# EAGLE design PID_heater (EAGLE 9.3.0)
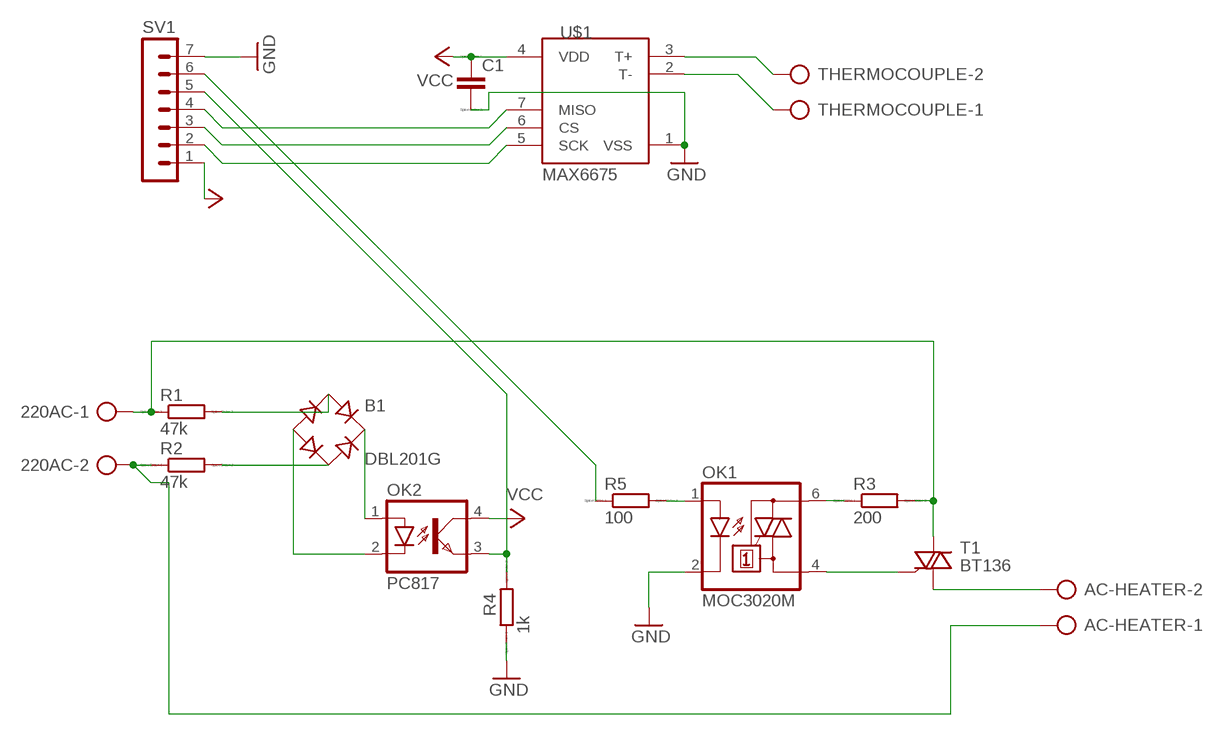
[diagram p0: schematic, sheet 1]

## Parts
220AC  AK300/2  [AK300/2]
AC-HEATER  AK300/2  [AK300/2]
B1  DBL201G  [DB]
C1  0.1u  C  [C0805]
OK1  MOC3020M  [DIL06]
OK2  PC817  [DIL04]
R1  47k  R  [R0805]
R2  47k  R  [R0805]
R3  200  R  [R0805]
R4  1k  R  [R0805]
R5  100  R  [R0805]
SV1  MA07-1  [MA07-1]
T1  BT136  [TO220AB]
THERMOCOUPLE  AK300/2  [AK300/2]
U$1  MAX6675  [SO08]

## Nets
GND: C1.2 OK1.2(C) R4.1 SV1.7 U$1.1(VSS)
N$1: OK1.6(A2) R3.1
N$2: 220AC.1 R1.1 R3.2 T1.2(A2)
N$3: 220AC.2 AC-HEATER.1 R2.1
N$4: B1.AC1 R1.2
N$5: B1.AC2 R2.2
N$6: B1.+ OK2.1(A)
N$7: B1.- OK2.2(C)
N$8: OK2.3(EMIT) R4.2 SV1.5
N$9: OK1.1(A) R5.2
N$10: OK1.4(A1) T1.3(G)
N$11: THERMOCOUPLE.2 U$1.3(T+)
N$12: AC-HEATER.2 T1.1(A1)
N$13: THERMOCOUPLE.1 U$1.2(T-)
N$14: R5.1 SV1.6
N$15: SV1.4 U$1.7(MISO)
N$16: SV1.3 U$1.6(CS)
N$17: SV1.2 U$1.5(SCK)
VCC: C1.1 OK2.4(COL) SV1.1 U$1.4(VDD)

## Library data of the parts
220AC AC-HEATER THERMOCOUPLE = con-ptr500:AK300/2: CONNECTOR; OC_FARNELL: unknown; OC_NEWARK: unknown
B1 = rectifier:DB?*G: Single Phase 1.0 AMP Glass Passivated Bridge Rectifier Taiwan Semiconductor Co.,Ltd. - TSC Source: http://www.taiwansemi.com/TSCbig5/ezcatfiles/cust/img/img/db101g.pdf http://www.ts.com.tw/db/pictures/modules/PDT/PDT060207001/DBLS201G.pdf
C1 = eagle-ltspice:C: CAPACITOR, European symbol; SPICEMODEL: NONE; SPICEPREFIX: C
OK1 = optocoupler:MOC30*M: RANDOM-PHASE OPTOISOLATORS TRIAC DRIVER OUTPUT Source: http://www.fairchildsemi.com MOC3020-M.pdf; MF: FAIRCHILD SEMICONDUCTOR; MPN: MOC3020-M; OC_FARNELL: 1505425; OC_NEWARK: 72K8895
OK2 = optocoupler:PC817: SHARP OPTO COUPLER; MPN: PC817X4J000F; OC_FARNELL: 9707727; OC_NEWARK: 97K7059
R1-R5 = eagle-ltspice:R: RESISTOR, European symbol; SPICEMODEL: NONE; SPICEPREFIX: R
SV1 = con-lstb:MA07-1: PIN HEADER; OC_FARNELL: unknown; OC_NEWARK: unknown
T1 = triac:BT136: Triac BT136 series E sensitive gate Source: http://www.nxp.com/acrobat_download/datasheets/BT136_SERIES_E_2.pdf
U$1 = max6675:MAX6675

## Board
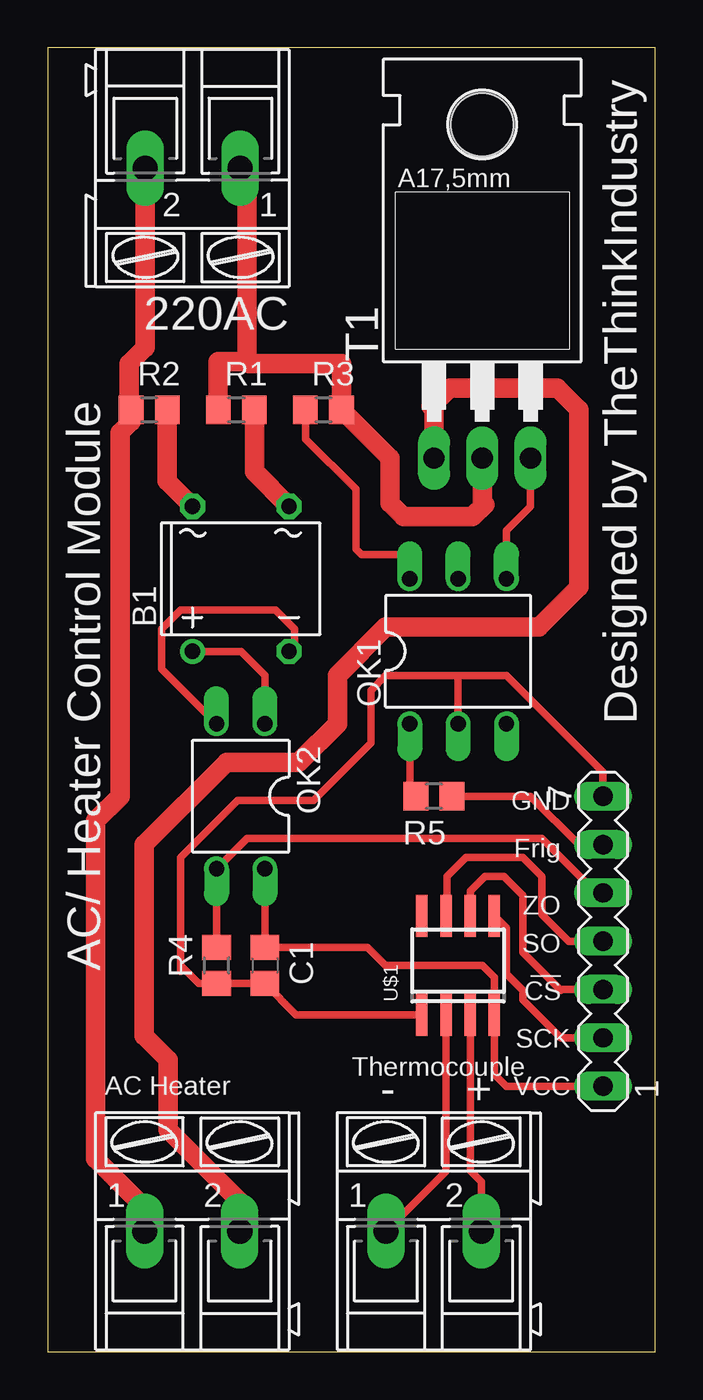
[diagram p1: board, top side]
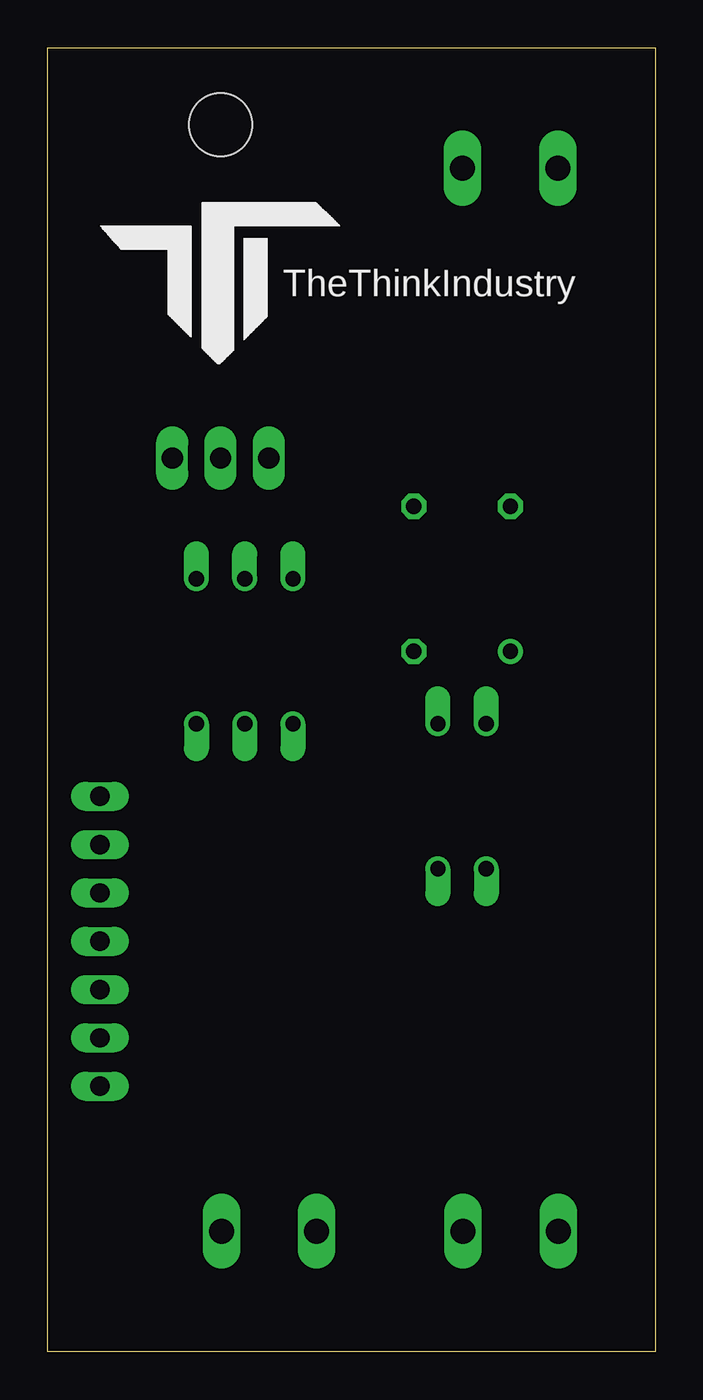
[diagram p2: board, bottom side, seen from below]

Size 31.96 x 68.57 mm. Coordinates in mm from the lower left corner, seen from the top.
Outline: 0,0 31.96,0 31.96,68.57 0,68.57 0,0
Copper layers (1*16): Top 0.035mm / dielectric 1.5mm / Bottom 0.035mm
Design rules "default": minimum track width 6mil, minimum drill 0.35mm, track to track 6mil, track to pad 6mil, pad to pad 6mil, via to via 6mil, smd to smd 6mil, copper to edge 40mil, drill to drill 6mil, minimum pad ring 10mil, minimum via ring 8mil, stop-mask expansion 4mil, vias tented up to drill 0mil, thermal gap 10mil

### Footprints (pad centres in the part's own frame; a part is rotated, then mirrored left to right if it is on the bottom)
AK300/2 = drill 1.321 long: 1 -2.515,0; 2 2.489,0
DB = drill 0.813: + -2.54,-3.81 | drill 0.813 octagon: - 2.54,-3.81; AC1 2.54,3.81; AC2 -2.54,3.81
C0805 = smd 1.3 x 1.5: 1 -0.95,0; 2 0.95,0
DIL06 = drill 0.813 offset: 1 -2.54,-3.81; 2 0,-3.81; 3 2.54,-3.81; 4 2.54,3.81; 5 0,3.81; 6 -2.54,3.81
DIL04 = drill 0.813 offset: 1 -1.27,-3.81; 2 1.27,-3.81; 3 1.27,3.81; 4 -1.27,3.81
R0805 = smd 1.3 x 1.5: 1 -0.95,0; 2 0.95,0
MA07-1 = drill 1.016 long: 1 -7.62,0; 2 -5.08,0; 3 -2.54,0; 4 0,0; 5 2.54,0; 6 5.08,0; 7 7.62,0
TO220AB = drill 1.118 long: 1 -2.54,-6.35; 2 0,-6.35; 3 2.54,-6.35 | hole 3.302: 0,11.176
SO08 = smd 0.6 x 2.2: 1 -1.905,-2.6; 2 -0.635,-2.6; 3 0.635,-2.6; 4 1.905,-2.6; 5 1.905,2.6; 6 0.635,2.6; 7 -0.635,2.6; 8 -1.905,2.6

### Placement (x,y rotation side)
220AC  7.62,62.23 180 top
AC-HEATER  7.62,6.35 0 top
B1  10.16,40.64 0 top
C1  11.43,20.32 270 top
OK1  21.59,36.83 0 top
OK2  10.16,29.21 180 top
R1  9.93,49.53 0 top
R2  5.35,49.53 0 top
R3  14.51,49.53 0 top
R4  8.89,20.32 90 top
R5  20.32,29.21 180 top
SV1  29.21,21.59 90 top
T1  22.86,53.34 0 top
THERMOCOUPLE  20.32,6.35 0 top
U$1  21.59,20.32 0 top

### Tracks (layer width: path | path; a pad name or v marks a point on that pad's centre or on a via)
GND
  Top 0.406: U$1.1 13.08,17.72 C1.2 R4.1 7.95,19.37 7,20.32 | OK1.2 21.59,35.56 | 21.59,35.56 17.78,35.56 17,34.78 17,32 14,29 10,29 7,26 7,20.32 | 7,20.32 7,20 | 21.59,35.56 24.13,35.56 29.21,30.48 SV1.7
N$1
  Top 0.406: OK1.6 19.05,41.91 16.51,41.91 16.21,42.21 16.21,45.35 13.56,48 R3.1
N$2
  Top 1.016: 220AC.1 10.48,61.88 10.48,52.07 | 10.48,52.07 10.59,51.96 15.46,51.96 R3.2 18,46.99 18,44.63 18.72,43.9 22.35,43.9 23,44.56 22.86,44.7 T1.2 | 10.48,52.07 8.98,52.07 R1.1
N$3
  Top 0.406: 5.11,6.68 5.11,7.59 4.93,7.76
  Top 1.016: 4.93,7.76 2.54,10.16 2.54,27.94 3.81,29.21 3.81,48.33 4.4,48.92 R2.1 4.28,49.65 4.28,51.96 5.13,52.81 220AC.2 | AC-HEATER.1 5.11,6.68
N$4
  Top 1.016: R1.2 10.88,46.27 B1.AC1
N$5
  Top 1.016: R2.2 6.3,45.77 B1.AC2
N$6
  Top 0.406: B1.+ 10.17,36.83 11.43,35.57 OK2.1
N$7
  Top 0.406: OK2.2 6,35.91 6,38 7,39 12,39 13,38 13,37.13 B1.-
N$8
  Top 0.406: R4.2 OK2.3 10.49,27 26,27 29,24 29.08,24 SV1.5
N$9
  Top 0.406: OK1.1 19.05,29.53 R5.2
N$10
  Top 0.406: OK1.4 24.13,43.18 25.4,44.45 T1.3
N$11
  Top 0.406: THERMOCOUPLE.2 22.81,8.94 22.23,9.53 U$1.3
N$12
  Top 0.305: 12.96,31.04 13,31
  Top 0.406: 5.08,16.62 5.08,16.84 | 9.41,31 13,31 13.21,31 13.22,31 13.28,31.06
  Top 1.016: AC-HEATER.2 10.11,7.92 6.35,11.68 6.35,15.35 5.08,16.62 | 5.08,16.84 5.08,26.67 9.41,31 13.21,31 | T1.1 20.32,49.56 20.17,49.71 21.14,50.67 26.8,50.67 27.94,49.53 27.94,40.2 25.83,38.1 17.78,38.1 15.24,35.56 15.24,33.02 13.28,31.06
N$13
  Top 0.406: U$1.2 20.95,9.5 THERMOCOUPLE.1
N$14
  Top 0.406: SV1.6 27.94,26.67 25.4,29.21 R5.1
N$15
  Top 0.406: U$1.7 21,22.96 21,25 22,26 25,26 26,25 26,23 27.41,21.59 SV1.4
N$16
  Top 0.406: U$1.6 22.23,24.23 23,25 24,25 25,24 25,21 27,19 27.05,19.05 SV1.3
N$17
  Top 0.406: U$1.5 24.13,22.29 24.13,19.87 25,19 25,18.5 26.99,16.51 SV1.2
VCC
  Top 0.406: OK2.4 C1.1 16.83,21.27 17.78,20.32 22.86,20.32 23.5,19.68 U$1.4 23.5,14.61 24.13,13.97 SV1.1

### Text on the board
tPlace: AC/ Heater Control Module | Designed by TheThinkIndustry | GND | Frig | ZO | SO | __ | CS | SCK | AC Heater | Thermocouple | VCC | - | +
bPlace: TheThinkIndustry